# Altium schematic sheet LO.SchDoc
size A4
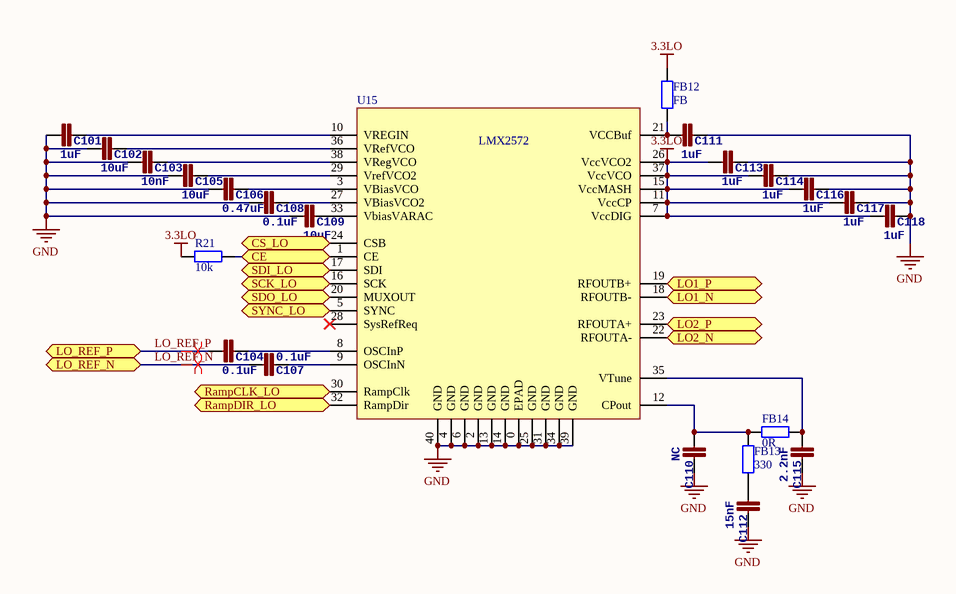
[diagram p0: LO.SchDoc]

## Parts
C101  1uF  [0201]
C102  10uF  [0402]
C103  10nF  [0201]
C104  0.1uF  [0201]
C105  10uF  [0402]
C106  0.47uF  [0402]
C107  0.1uF  [0201]
C108  0.1uF  [0201]
C109  10uF  [0402]
C110  NC  [0201]
C111  1uF  [0201]
C112  15nF  [0201]
C113  1uF  [0201]
C114  1uF  [0201]
C115  2.2nF  [0201]
C116  1uF  [0201]
C117  1uF  [0201]
C118  1uF  [0201]
FB12  FB  [0402]
FB13  330  [0201]
FB14  0R  [0201]
R21  10k  [0402]
U15  LMX2572  [LMX2572]

## Ports
CE, CS_LO, LO1_N, LO1_P, LO2_N, LO2_P, LO_REF_N, LO_REF_P, RampCLK_LO, RampDIR_LO, SCK_LO, SDI_LO, SDO_LO, SYNC_LO

## Nets
3.3LO: C113.1 C114.1 C116.1 C117.1 C118.1 FB12.1 R21.1 U15.7(VccDIG) U15.11(VccCP) U15.15(VccMASH) U15.26(VccVCO2) U15.37(VccVCO)
GND: C101.1 C102.1 C103.1 C105.1 C106.1 C108.1 C109.1 C110.2 C111.2 C112.2 C113.2 C114.2 C115.2 C116.2 C117.2 C118.2 U15.0(EPAD) U15.2(GND) U15.4(GND) U15.6(GND) U15.13(GND) U15.14(GND) U15.25(GND) U15.31(GND) U15.34(GND) U15.39(GND) U15.40(GND)
CE: R21.2 U15.1(CE) ; port CE
CS_LO: U15.24(CSB) ; port CS_LO
LO1_N: U15.18(RFOUTB-) ; port LO1_N
LO1_P: U15.19(RFOUTB+) ; port LO1_P
LO2_N: U15.22(RFOUTA-) ; port LO2_N
LO2_P: U15.23(RFOUTA+) ; port LO2_P
LO_REF_N: C107.1 ; port LO_REF_N
LO_REF_P: C104.1 ; port LO_REF_P
RampCLK_LO: U15.30(RampClk) ; port RampCLK_LO
RampDIR_LO: U15.32(RampDir) ; port RampDIR_LO
SCK_LO: U15.16(SCK) ; port SCK_LO
SDI_LO: U15.17(SDI) ; port SDI_LO
SDO_LO: U15.20(MUXOUT) ; port SDO_LO
SYNC_LO: U15.5(SYNC) ; port SYNC_LO
NetC101_2: C101.2 U15.10(VREGIN)
NetC102_2: C102.2 U15.36(VRefVCO)
NetC103_2: C103.2 U15.38(VRegVCO)
NetC104_2: C104.2 U15.8(OSCInP)
NetC105_2: C105.2 U15.29(VrefVCO2)
NetC106_2: C106.2 U15.3(VBiasVCO)
NetC107_2: C107.2 U15.9(OSCInN)
NetC108_2: C108.2 U15.27(VBiasVCO2)
NetC109_2: C109.2 U15.33(VbiasVARAC)
NetC110_1: C110.1 FB13.2 FB14.2 U15.12(CPout)
NetC111_1: C111.1 FB12.2 U15.21(VCCBuf)
NetC112_1: C112.1 FB13.1
NetC115_1: C115.1 FB14.1 U15.35(VTune)

Not connected (* = marked no-connect by the designer): U15 28(SysRefReq)*

## Layout directives
differential pair: LO_REF_N, LO_REF_P

## Library data of the parts
C101-C118 = CAP0402-CAP: <b>Capacitor</b> / Standard 0603 ceramic capacitor, and 0.1" leaded capacitor.; PARTNO: CC0402ZRY5V7BB104
FB12-FB14 R21 = Res2: Resistor; Published: 8-Jun-2000; LatestRevisionDate: 17-Jul-2002; LatestRevisionNote: Re-released for DXP Platform.; PackageReference: AXIAL-0.4; Publisher: Altium Limited; PackageDescription: Axial Device, Thru-Hole; 2 Leads; 0.4 in Pin Spacing